# EAGLE design BMS (EAGLE 8.4.1)
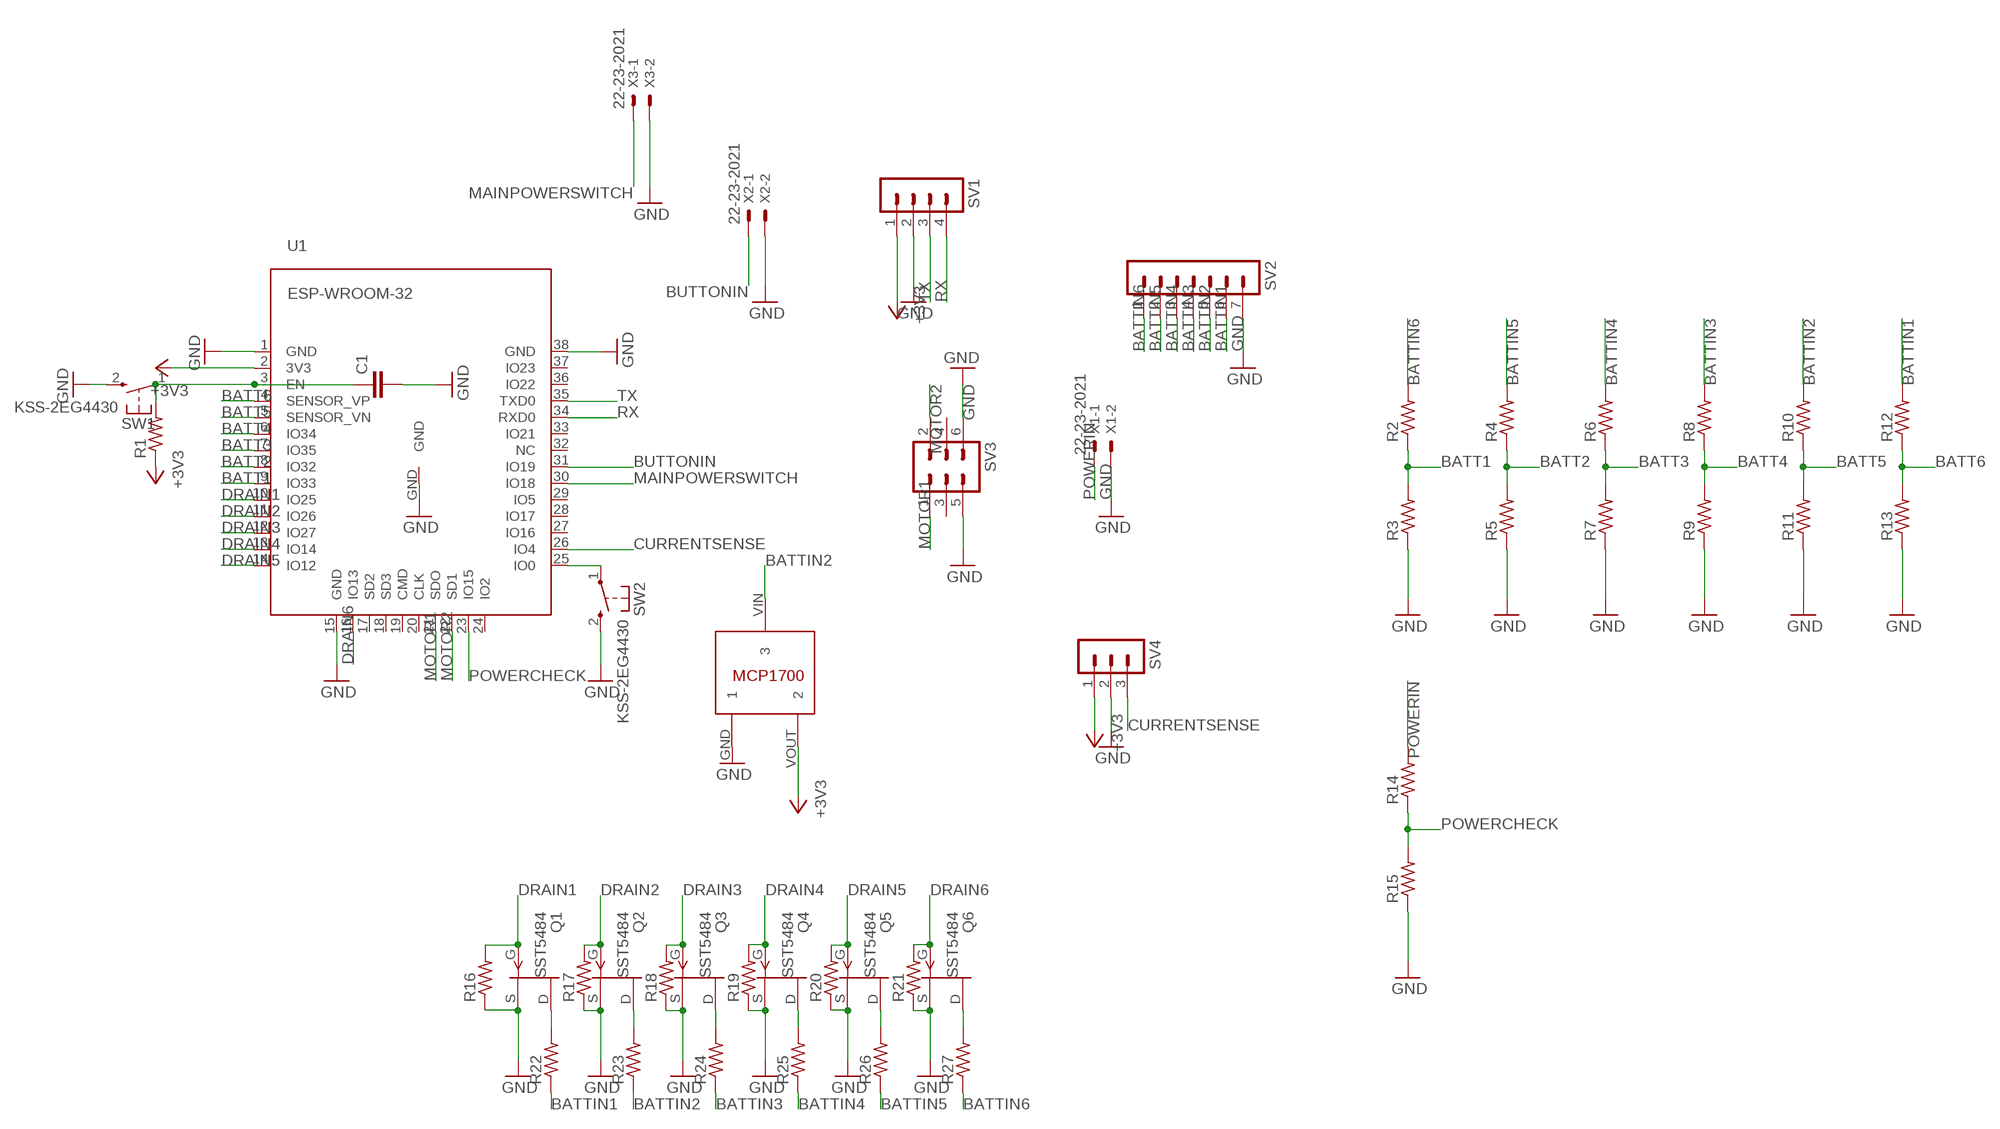
[diagram p0: schematic, sheet 1]

## Parts
C1  C-EUC0402  [C0402]
Q1  SST5484  [SOT23]
Q2  SST5484  [SOT23]
Q3  SST5484  [SOT23]
Q4  SST5484  [SOT23]
Q5  SST5484  [SOT23]
Q6  SST5484  [SOT23]
R1  R-US_R0805  [R0805]
R2  R-US_M0805  [M0805]
R3  R-US_M0805  [M0805]
R4  R-US_M0805  [M0805]
R5  R-US_M0805  [M0805]
R6  R-US_M0805  [M0805]
R7  R-US_M0805  [M0805]
R8  R-US_M0805  [M0805]
R9  R-US_M0805  [M0805]
R10  R-US_M0805  [M0805]
R11  R-US_M0805  [M0805]
R12  R-US_M0805  [M0805]
R13  R-US_M0805  [M0805]
R14  R-US_M0805  [M0805]
R15  R-US_M0805  [M0805]
R16  R-US_M0805  [M0805]
R17  R-US_M0805  [M0805]
R18  R-US_M0805  [M0805]
R19  R-US_M0805  [M0805]
R20  R-US_M0805  [M0805]
R21  R-US_M0805  [M0805]
R22  R-US_M0805  [M0805]
R23  R-US_M0805  [M0805]
R24  R-US_M0805  [M0805]
R25  R-US_M0805  [M0805]
R26  R-US_M0805  [M0805]
R27  R-US_M0805  [M0805]
SV1  MA04-1  [MA04-1]
SV2  MA07-1  [MA07-1]
SV3  MA03-2  [MA03-2]
SV4  MA03-1  [MA03-1]
SW1  KSS-2EG4430  [KSS-2EG4430]
SW2  KSS-2EG4430  [KSS-2EG4430]
U1  ESP-WROOM-32  [ESP-WROOM-32]
U$1  MCP1700T-3302E/TT  [MCP1700T-3302E/TT]
X1  22-23-2021  [22-23-2021]
X2  22-23-2021  [22-23-2021]
X3  22-23-2021  [22-23-2021]

## Nets
+3V3: R1.1 SV1.1 SV4.1 U1.2(3V3) U$1.VOUT
BATT1: R2.1 R3.2 U1.9(IO33)
BATT2: R4.1 R5.2 U1.8(IO32)
BATT3: R6.1 R7.2 U1.7(IO35)
BATT4: R8.1 R9.2 U1.6(IO34)
BATT5: R10.1 R11.2 U1.5(SENSOR_VN)
BATT6: R12.1 R13.2 U1.4(SENSOR_VP)
BATTIN1: R12.2 R22.1 SV2.6
BATTIN2: R10.2 R23.1 SV2.5 U$1.VIN
BATTIN3: R8.2 R24.1 SV2.4
BATTIN4: R6.2 R25.1 SV2.3
BATTIN5: R4.2 R26.1 SV2.2
BATTIN6: R2.2 R27.1 SV2.1
BUTTONIN: U1.31(IO19) X2.1
CURRENTSENSE: SV4.3 U1.26(IO4)
DRAIN1: Q1.3(G) R16.2 U1.10(IO25)
DRAIN2: Q2.3(G) R17.2 U1.11(IO26)
DRAIN3: Q3.3(G) R18.2 U1.12(IO27)
DRAIN4: Q4.3(G) R19.2 U1.13(IO14)
DRAIN5: Q5.3(G) R20.2 U1.14(IO12)
DRAIN6: Q6.3(G) R21.2 U1.16(IO13)
GND: C1.2 Q1.2(S) Q2.2(S) Q3.2(S) Q4.2(S) Q5.2(S) Q6.2(S) R3.1 R5.1 R7.1 R9.1 R11.1 R13.1 R15.1 R16.1 R17.1 R18.1 R19.1 R20.1 R21.1 SV1.2 SV2.7 SV3.5 SV3.6 SV4.2 SW1.2(S) SW2.2(S) U1.1(GND) U1.15(GND) U1.38(GND) U1.GND U$1.GND X1.2 X2.2 X3.2
MAINPOWERSWITCH: U1.30(IO18) X3.1
MOTOR1: SV3.1 U1.21(SDO)
MOTOR2: SV3.2 U1.22(SD1)
N$2: C1.1 R1.2 SW1.1(P) U1.3(EN)
N$3: SW2.1(P) U1.25(IO0)
N$14: Q6.1(D) R27.2
N$15: Q5.1(D) R26.2
N$16: Q4.1(D) R25.2
N$17: Q3.1(D) R24.2
N$18: Q2.1(D) R23.2
N$19: Q1.1(D) R22.2
POWERCHECK: R14.1 R15.2 U1.23(IO15)
POWERIN: R14.2 X1.1
RX: SV1.4 U1.34(RXD0)
TX: SV1.3 U1.35(TXD0)
Unconnected: SV3.3 SV3.4 U1.17(SD2) U1.18(SD3) U1.19(CMD) U1.20(CLK) U1.24(IO2) U1.27(IO16) U1.28(IO17) U1.29(IO5) U1.32(NC) U1.33(IO21) U1.36(IO22) U1.37(IO23)

## Library data of the parts
C1 = rcl:C-EU: CAPACITOR, European symbol
Q1-Q6 = transistor-fet:?548*: N-Channel JFETs Source: VISHAY 2N5484.pdf Compatible: TO92 2N5245 J304 J305 U310 J308 J309 J310 TO72 2N4416 2N4416A 2N3823 2N4351 3N169 3N170 3N171 MFE3002 TO18 2N3796 2N3797 MFE825 Source: Motorola European Master Guide Pacge 3-59
R1 R16-R27 = rcl:R-US_: RESISTOR, American symbol
R2-R15 = resistor:R-US_: RESISTOR, American symbol
SV1 = con-lstb:MA04-1: PIN HEADER; OC_FARNELL: unknown; OC_NEWARK: unknown
SV2 = con-lstb:MA07-1: PIN HEADER; OC_FARNELL: unknown; OC_NEWARK: unknown
SV3 = con-lstb:MA03-2: PIN HEADER; OC_FARNELL: unknown; OC_NEWARK: unknown
SV4 = con-lstb:MA03-1: PIN HEADER; OC_FARNELL: unknown; OC_NEWARK: unknown
SW1 SW2 = buttons:KSS-2EG4430: Size: 3x6mm Height: 5mm from PCB Rating: DC12v 50mA Travel: 0.25±0.10mm Operating Force: 180±50gf Return Force: 60gf min Contact resistance: 100m? max Insulation resistance: 100M? min Operating life?50,000 cycles
U1 = esp32_2:ESP-WROOM-32
U$1 = MCP1700T-3302E_TT:MCP1700T-3302E/TT: Microchip LDO "MCP1700" in a 3-Pin SOT-23 package. ID: MCP1700T-3302E/TT
X1-X3 = con-molex:22-23-2021: .100" (2.54mm) Center Header - 2 Pin; MF: MOLEX; MPN: 22-23-2021; OC_FARNELL: 1462926; OC_NEWARK: 25C3832

## Board
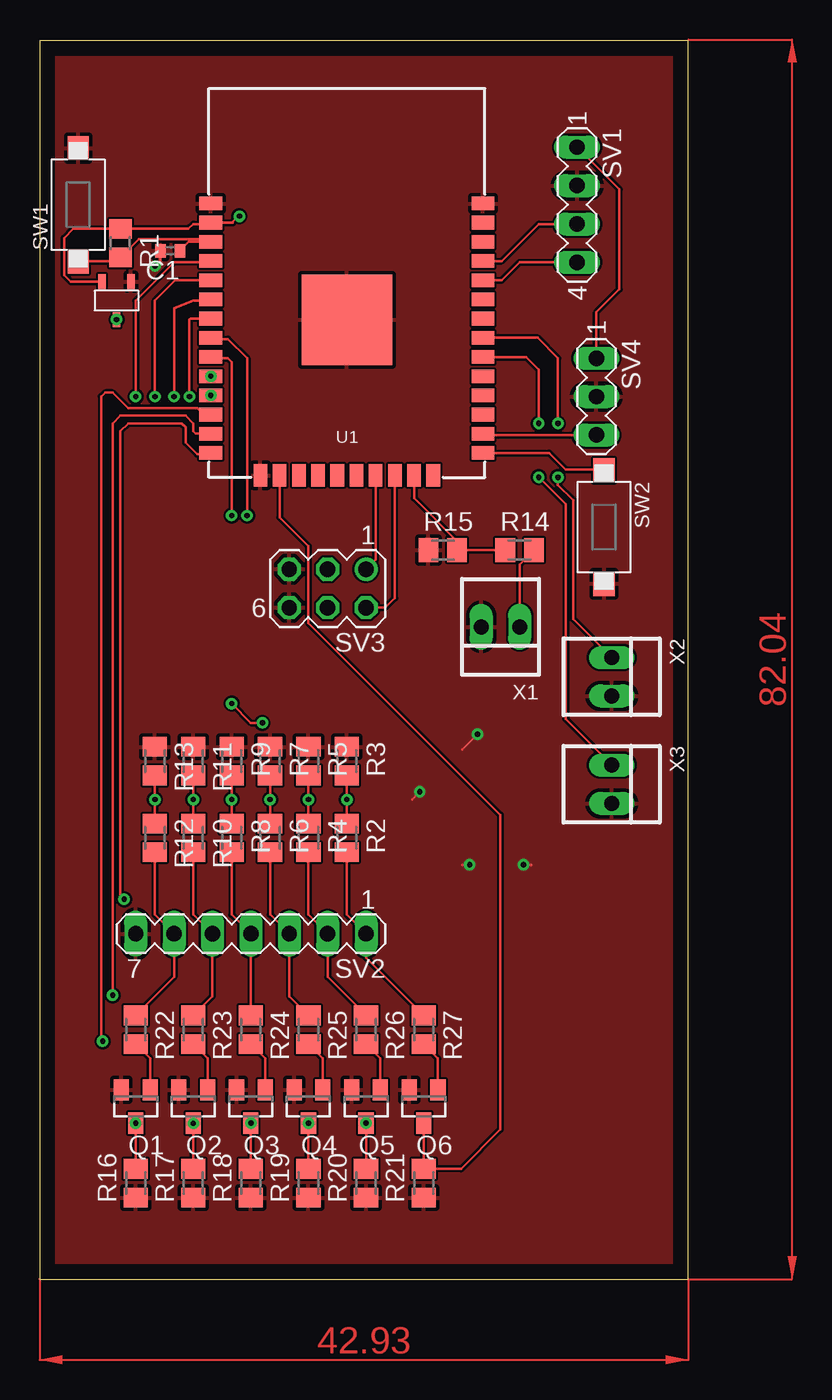
[diagram p1: board, top side]
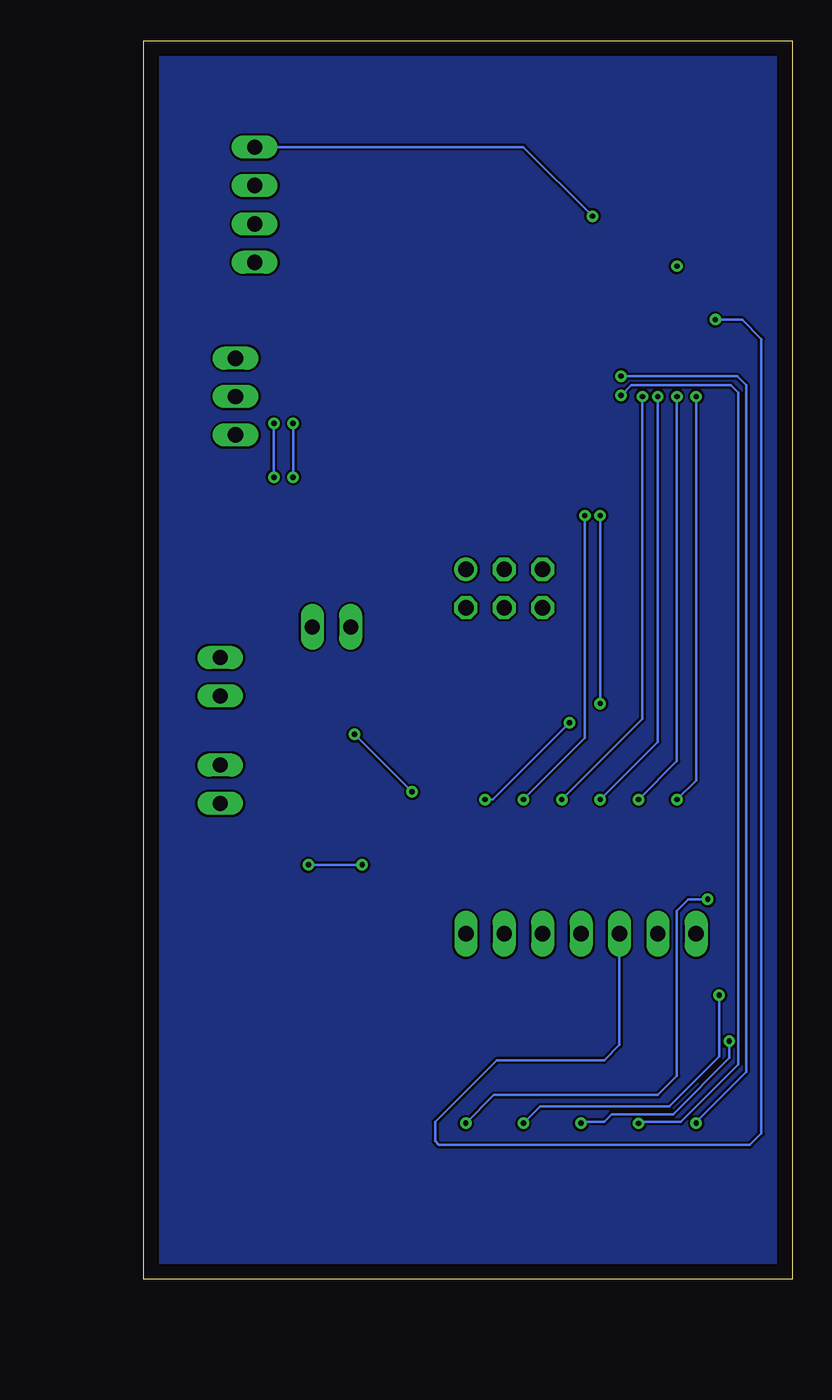
[diagram p2: board, bottom side, seen from below]

Size 42.91 x 81.97 mm. Coordinates in mm from the lower left corner, seen from the top.
Outline: 0,0 42.91,0 42.91,81.97 0,81.97 0,0
Copper layers (1*16): Top 0.035mm / dielectric 1.5mm / Bottom 0.035mm
Design rules "default *": minimum track width 6mil, minimum drill 0.35mm, track to track 6mil, track to pad 6mil, pad to pad 6mil, via to via 6mil, smd to smd 6mil, copper to edge 40mil, drill to drill 6mil, minimum pad ring 10mil, minimum via ring 8mil, stop-mask expansion 4mil, vias tented up to drill 0mil, thermal gap 10mil

### Footprints (pad centres in the part's own frame; a part is rotated, then mirrored left to right if it is on the bottom)
C0402 = smd 0.7 x 0.9: 1 -0.65,0; 2 0.65,0
SOT23 = smd 1 x 1.4: 1 -0.95,-1.1; 2 0.95,-1.1; 3 0,1.1
R0805 = smd 1.3 x 1.5: 1 -0.95,0; 2 0.95,0
M0805 = smd 1.3 x 1.6: 1 -0.95,0; 2 0.95,0
MA04-1 = drill 1.016 long: 1 -3.81,0; 2 -1.27,0; 3 1.27,0; 4 3.81,0
MA07-1 = drill 1.016 long: 1 -7.62,0; 2 -5.08,0; 3 -2.54,0; 4 0,0; 5 2.54,0; 6 5.08,0; 7 7.62,0
MA03-2 = drill 1.016: 1 -2.54,-1.27 | drill 1.016 octagon: 2 -2.54,1.27; 3 0,-1.27; 4 0,1.27; 5 2.54,-1.27; 6 2.54,1.27
MA03-1 = drill 1.016 long: 1 -2.54,0; 2 0,0; 3 2.54,0
KSS-2EG4430 = smd 1.6 x 1.4: 1 -3.75,0; 2 3.75,0
ESP-WROOM-32 = smd 0.9 x 1.5: 1 7.7,9; 2 6.43,9; 3 5.16,9; 4 3.89,9; 5 2.62,9; 6 1.35,9; 7 0.08,9; 8 -1.19,9; 9 -2.46,9; 10 -3.73,9; 11 -5,9; 12 -6.27,9; 13 -7.54,9; 14 -8.81,9; 25 -8.81,-9; 26 -7.54,-9; 27 -6.27,-9; 28 -5,-9; 29 -3.73,-9; 30 -2.46,-9; 31 -1.19,-9; 32 0.08,-9; 33 1.35,-9; 34 2.62,-9; 35 3.89,-9; 36 5.16,-9; 37 6.43,-9; 38 7.7,-9 | smd 1.5 x 0.9: 15 -10.3,5.715; 16 -10.3,4.445; 17 -10.3,3.175; 18 -10.3,1.905; 19 -10.3,0.635; 20 -10.3,-0.635; 21 -10.3,-1.905; 22 -10.3,-3.175; 23 -10.3,-4.445; 24 -10.3,-5.715 | smd 6 x 6: GND 0,0
MCP1700T-3302E/TT = smd 0.5 x 1: GND -0.95,-1.25; VIN 0,1.25; VOUT 0.95,-1.25
22-23-2021 = drill 1 long: 1 -1.27,0; 2 1.27,0

### Placement (x,y rotation side)
C1  8.64,68.07 180 top
Q1  6.35,11.43 180 top
Q2  10.16,11.43 180 top
Q3  13.97,11.43 180 top
Q4  17.78,11.43 180 top
Q5  21.59,11.43 180 top
Q6  25.4,11.43 180 top
R1  5.33,68.58 270 top
R2  20.32,29.21 270 top
R3  20.32,34.29 270 top
R4  17.78,29.21 270 top
R5  17.78,34.29 270 top
R6  15.24,29.21 270 top
R7  15.24,34.29 270 top
R8  12.7,29.21 270 top
R9  12.7,34.29 270 top
R10  10.16,29.21 270 top
R11  10.16,34.29 270 top
R12  7.62,29.21 270 top
R13  7.62,34.29 270 top
R14  31.75,48.26 0 top
R15  26.67,48.26 0 top
R16  6.35,6.35 90 top
R17  10.16,6.35 90 top
R18  13.97,6.35 90 top
R19  17.78,6.35 90 top
R20  21.59,6.35 90 top
R21  25.4,6.35 90 top
R22  6.35,16.51 270 top
R23  10.16,16.51 270 top
R24  13.97,16.51 270 top
R25  17.78,16.51 270 top
R26  21.59,16.51 270 top
R27  25.4,16.51 270 top
SV1  35.56,71.12 270 top
SV2  13.97,22.86 180 top
SV3  19.05,45.72 180 top
SV4  36.83,58.42 270 top
SW1  2.54,71.12 90 top
SW2  37.34,49.78 270 top
U1  20.32,63.5 90 top
U$1  5.08,64.77 180 top
X1  30.48,43.18 180 top
X2  37.85,39.88 270 top
X3  37.85,32.77 270 top

### Tracks (layer width: path | path; a pad name or v marks a point on that pad's centre or on a via)
+3V3  (via drill 0.35)
  Top 0.152: U$1.VOUT 2.07,66.02 1.61,66.47 1.61,68.92 2.22,69.53 R1.1 9.84,69.53 10.16,69.85 11.24,69.85 U1.2 12.7,69.93 | 12.7,69.93 12.78,69.93 | SV4.1 36.83,64.01 38.35,65.53 38.35,72.14 SV1.1 | 12.7,69.93 13.13,70.36 v13.21,70.36
  Bottom 0.152: v13.21,70.36 17.78,74.93 SV1.1
BATT1  (via drill 0.35)
  Top 0.152: R2.1 v20.32,31.75 R3.2 | U1.9 11.24,60.96 12.45,60.96 12.7,60.71 v12.7,50.55 | v12.7,38.1 13.97,36.83 v14.73,36.83
  Bottom 0.152: v12.7,50.55 v12.7,38.1 | v14.73,36.83 19.81,31.75 v20.32,31.75
BATT2  (via drill 0.35)
  Top 0.152: R5.2 v17.78,31.75 R4.1 | U1.8 11.4,62.23 12.45,62.23 13.72,60.96 v13.72,50.55
  Bottom 0.152: v13.72,50.55 13.72,35.81 v17.78,31.75
BATT3  (via drill 0.35)
  Top 0.152: R6.1 v15.24,31.75 R7.2 | U1.7 9.99,63.58 9.91,63.5 v9.91,58.42
  Bottom 0.152: v9.91,58.42 9.91,37.08 v15.24,31.75
BATT4  (via drill 0.35)
  Top 0.152: R9.2 v12.7,31.75 R8.1 | v8.89,58.42 8.89,64.26 10.16,64.77 11.24,64.77 U1.6
  Bottom 0.152: v8.89,58.42 8.89,35.56 v12.7,31.75
BATT5  (via drill 0.35)
  Top 0.152: R10.1 v10.16,31.75 R11.2 | v7.62,58.42 7.62,64.77 8.97,66.12 U1.5
  Bottom 0.152: v7.62,58.42 7.62,34.29 v10.16,31.75
BATT6  (via drill 0.35)
  Top 0.152: R13.2 v7.62,31.75 R12.1 | U1.4 11.24,67.31 8.89,67.31 6.35,64.77 v6.35,58.42
  Bottom 0.152: v7.62,31.75 6.35,33.02 v6.35,58.42
BATTIN1
  Top 0.152: R12.2 7.62,24.13 SV2.6 8.89,20 R22.1
BATTIN2  (via drill 0.35)
  Top 0.152: R10.2 10.16,24.13 SV2.5 11.43,18.73 R23.1
  Bottom 0.152: SV2.5 11.43,15.49 12.45,14.48 19.56,14.48 23.62,10.41 23.62,9.14 23.37,8.89 2.79,8.89 2.03,9.65 2.03,62.23 3.3,63.5 5.08,63.5 U$1.VIN
  other vias: 5.08,63.52
BATTIN3
  Top 0.152: R8.2 12.7,24.13 SV2.4 R24.1
BATTIN4
  Top 0.152: R6.2 15.24,24.13 SV2.3 16.51,18.73 R25.1
BATTIN5
  Top 0.152: R4.2 17.78,24.13 SV2.2 19.05,20 R26.1
BATTIN6
  Top 0.152: R2.2 20.32,24.13 SV2.1 21.59,21.27 R27.1
BUTTONIN  (via drill 0.35)
  Top 0.152: X2.1 35.31,43.69 35.31,51.56 34.29,52.58 v34.29,53.09 | v34.29,56.64 34.29,60.96 32.94,62.31 U1.31
  Bottom 0.152: v34.29,53.09 v34.29,56.64
CURRENTSENSE
  Top 0.152: U1.26 29.32,55.88 SV4.3
DRAIN1  (via drill 0.35)
  Top 0.152: R16.2 Q1.3
  Bottom 0.152: U1.10 3.64,59.77 3.05,59.18 3.05,13.72 6.35,10.41 Q1.3
  other vias: 11.32,59.77 6.35,10.33
DRAIN2  (via drill 0.35)
  Top 0.152: R17.2 v10.16,10.31 Q2.3
  Bottom 0.152: U1.11 10.64,59.18 4.06,59.18 3.56,58.67 3.56,14.22 7.37,10.41 10.16,10.41 v10.16,10.31
  other vias: 11.32,58.5
DRAIN3  (via drill 0.35)
  Top 0.152: Q3.3 R18.2 | U1.12 10.84,57.23 10.41,57.66 5.84,57.66 4.83,58.67 4.32,58.67 4.06,58.42 4.06,15.75 v4.16,15.75
  Bottom 0.152: v4.16,15.75 4.16,14.63 7.87,10.92 11.94,10.92 12.45,10.41 13.97,10.41 Q3.3
  other vias: 13.97,10.33
DRAIN4  (via drill 0.35)
  Top 0.152: R19.2 Q4.3 | v4.83,18.8 4.83,56.64 5.33,57.15 9.65,57.15 10.16,56.64 10.16,56.13 10.33,55.96 U1.13
  Bottom 0.152: Q4.3 16.68,11.43 8.13,11.43 4.83,14.73 v4.83,18.8
  other vias: 17.78,10.33
DRAIN5  (via drill 0.35)
  Top 0.152: R20.2 Q5.3 | U1.14 11.24,54.61 10.41,54.61 9.65,55.37 9.65,56.39 9.4,56.64 5.84,56.64 5.33,56.13 5.33,25.4 v5.59,25.15
  Bottom 0.152: Q5.3 19.73,12.19 8.89,12.19 7.62,13.46 7.62,24.38 6.86,25.15 v5.59,25.15
  other vias: 21.59,10.33
DRAIN6
  Top 0.152: Q6.3 R21.2 27.87,7.3 30.48,9.91 30.48,30.73 17.78,43.43 17.78,48.51 15.88,50.42 U1.16
GND  (via drill 0.35)
  Top 0.152: 24.64,31.75 v25.15,32.26 | v28.96,36.07 27.94,35.05 | 27.94,27.43 v28.45,27.43 | v32,27.43 32.51,27.43 | C1.2 7.99,67.42 v7.62,67.06
  Bottom 0.152: v25.15,32.26 v28.96,36.07 | v28.45,27.43 v32,27.43
  pour Top: 0,82.04 0,0 42.93,0 42.93,82.04
MAINPOWERSWITCH  (via drill 0.35)
  Top 0.152: U1.30 32.18,61.04 33.02,60.2 v33.02,56.64 | v33.02,53.09 34.8,51.31 34.8,37.08 X3.1
  Bottom 0.152: v33.02,56.64 v33.02,53.09
MOTOR1
  Top 0.152: SV3.1 22.23,47.62 U1.21
MOTOR2
  Top 0.152: SV3.2 22.86,44.45 23.5,45.09 U1.22
N$1
  pour Bottom: 0,0 0,82.04 42.93,82.04 42.93,0
N$2
  Top 0.152: SW1.1 5.33,67.37 R1.2 6.54,68.83 11.15,68.83 U1.3 9.87,68.66 C1.1
N$3
  Top 0.152: U1.25 33.7,54.69 34.8,53.59 37.28,53.59 SW2.1
N$14
  Top 0.152: Q6.1 26.35,14.61 R27.2
N$15
  Top 0.152: Q5.1 22.54,14.61 R26.2
N$16
  Top 0.152: Q4.1 18.73,14.61 R25.2
N$17
  Top 0.152: Q3.1 14.92,14.61 R24.2
N$18
  Top 0.152: Q2.1 11.11,14.61 R23.2
N$19
  Top 0.152: Q1.1 7.3,14.61 R22.2
POWERCHECK
  Top 0.152: 27.69,48.26 R14.1 | 27.69,48.26 R15.2 | U1.23 24.77,51.69 27.69,48.77 27.69,48.26
POWERIN
  Top 0.152: X1.1 31.75,47.31 R14.2
RX
  Top 0.152: U1.34 30.56,66.12 31.75,67.31 SV1.4
TX
  Top 0.152: U1.35 30.56,67.39 33.02,69.85 SV1.3
(copper drawn outside any net)
  shapes: Top area x2